# Altium schematic sheet 10_CONNECTOR.SchDoc: SENSEI Base Board - Connectors
size A3; DrawnBy: Sebastian Frey; Organization: Integrated Systems Laboratory; DocumentNumber: 11; Revision: v1.1; SheetNumber: 11; SheetTotal: 12
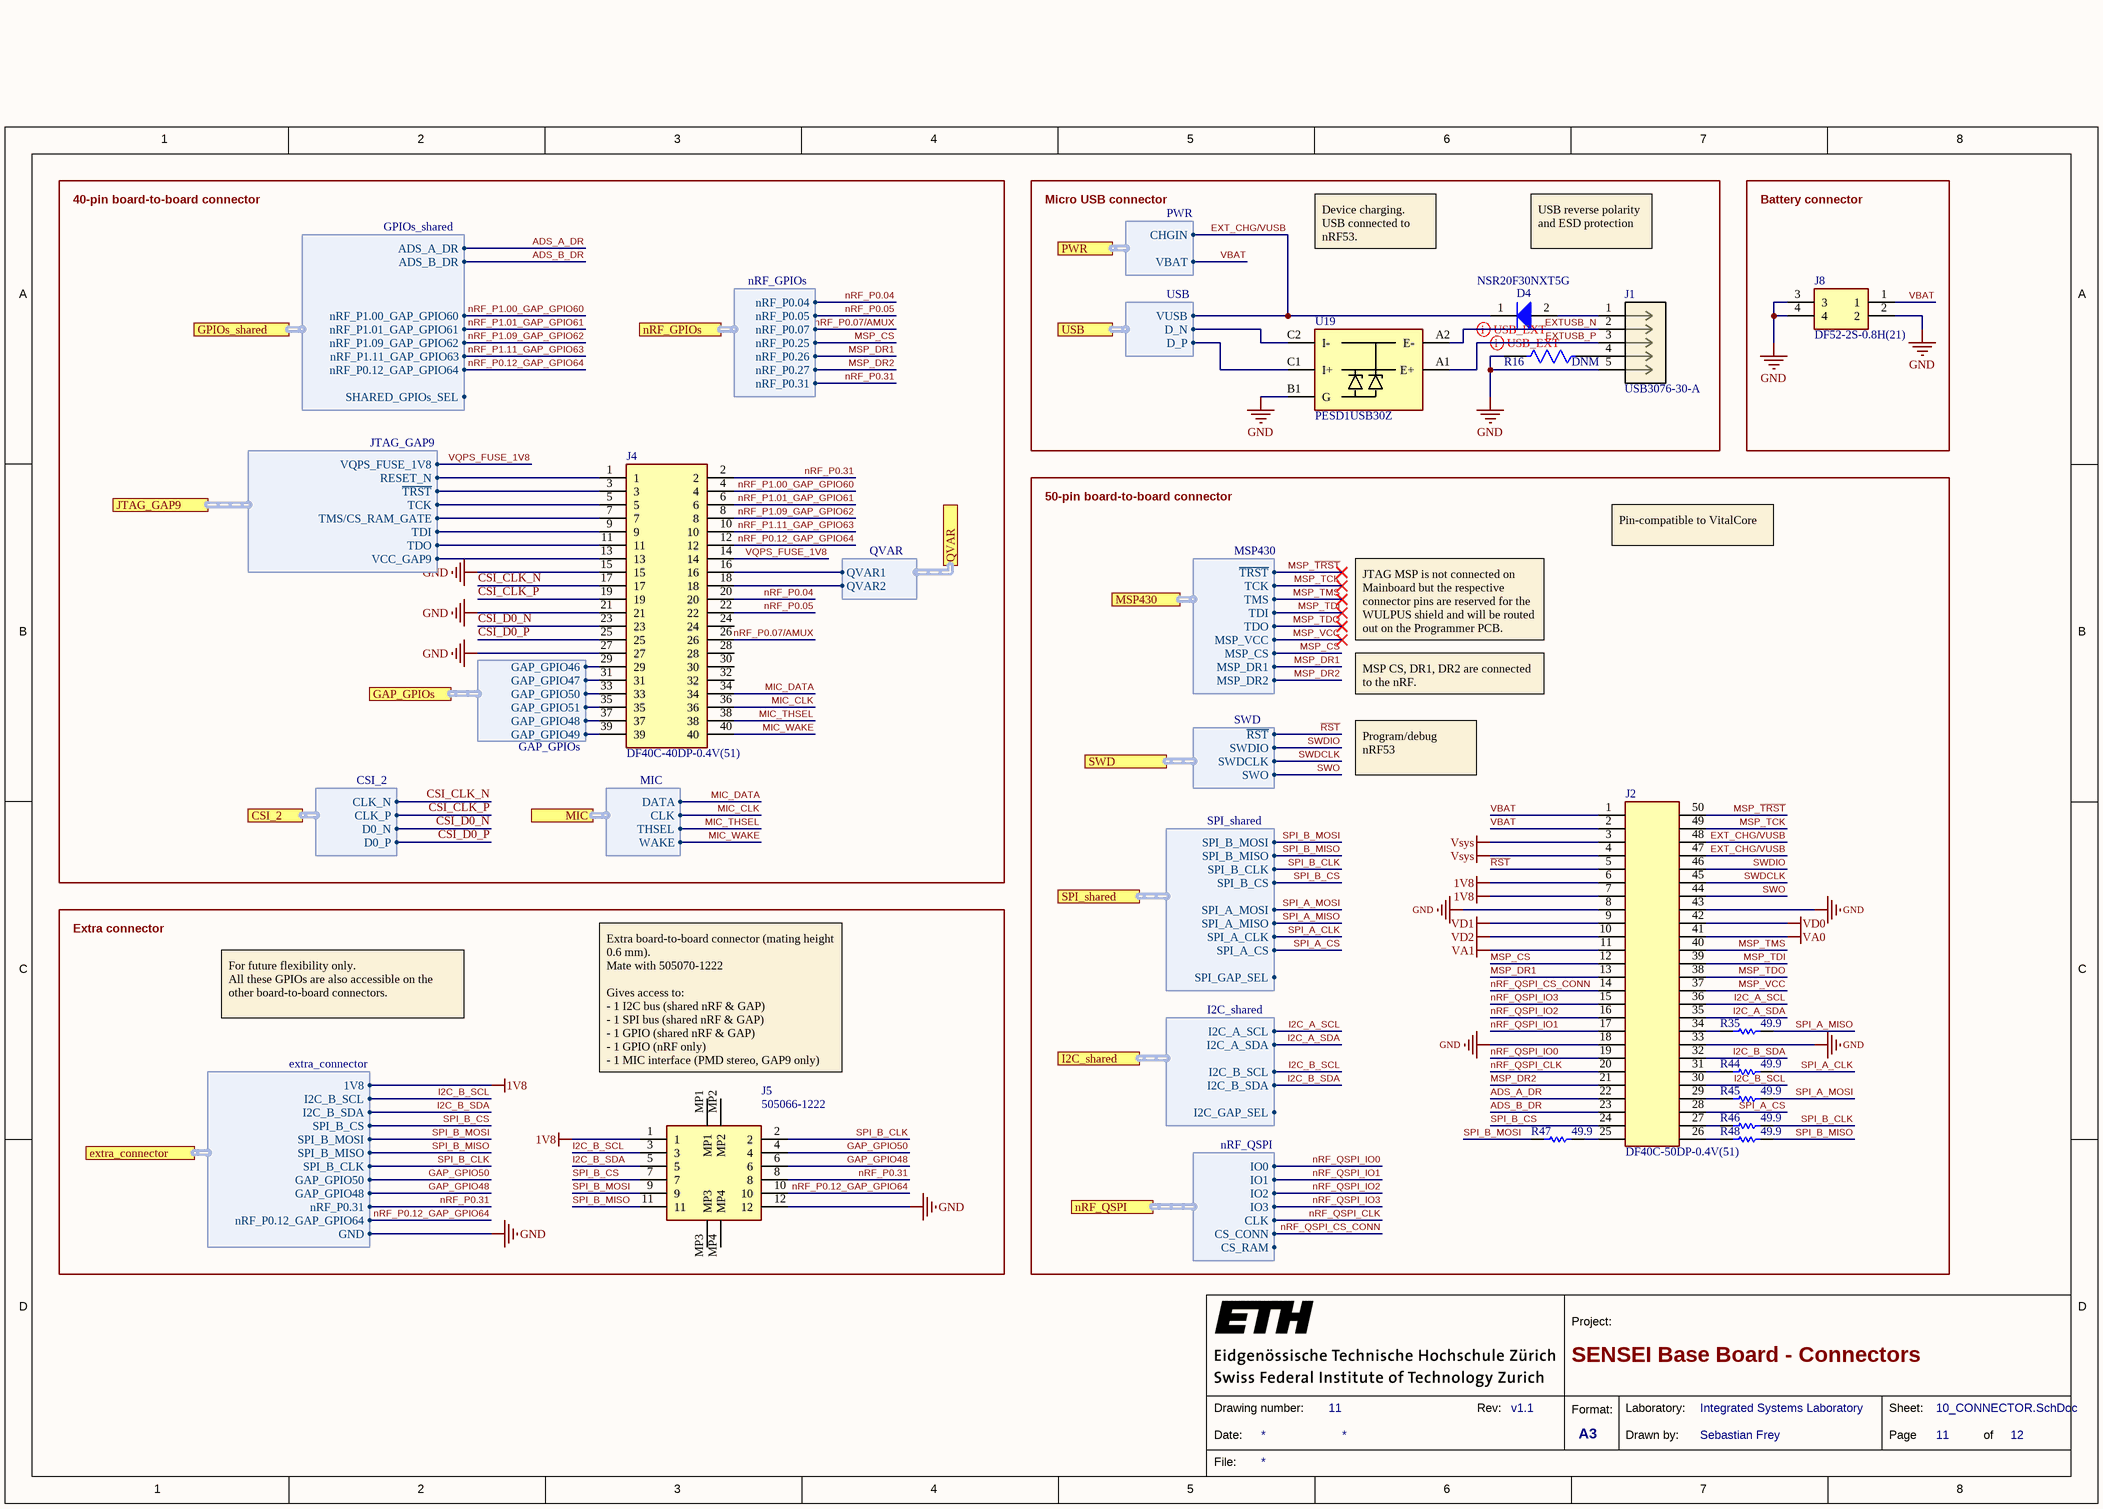
[diagram p0: 10_CONNECTOR.SchDoc]

## Parts
D4  NSR20F30NXT5G  [ONSC-DSN-2-512AB-01_V]
J1  USB3076-30-A  [CONN_USB3076-30-A_GCT]
J2  DF40C-50DP-0.4V(51)  [CONN_COMBI_50P]
J4  DF40C-40DP-0.4V(51)  [FP-DF40C-40DP-0_4V_51-MFG]
J5  505066-1222  [5050661222]
J8  DF52-2S-0.8H(21)  [DF522S08H21]
R16  DNM  [0201]
R35  Resistance: 49.9  [RESC0603X28X15ML05T05]  (hidden comment: CRCW020149R9FNED)
R44  Resistance: 49.9  [RESC0603X28X15ML05T05]  (hidden comment: CRCW020149R9FNED)
R45  Resistance: 49.9  [RESC0603X28X15ML05T05]  (hidden comment: CRCW020149R9FNED)
R46  Resistance: 49.9  [RESC0603X28X15ML05T05]  (hidden comment: CRCW020149R9FNED)
R47  Resistance: 49.9  [RESC0603X28X15ML05T05]  (hidden comment: CRCW020149R9FNED)
R48  Resistance: 49.9  [RESC0603X28X15ML05T05]  (hidden comment: CRCW020149R9FNED)
U19  PESD1USB30Z  [WLCSP_5_2-1-2_P0.4]

## Blocks framed on the sheet
40-pin board-to-board connector: J4
Micro USB connector: D4 J1 R16 U19
Battery connector: J8
50-pin board-to-board connector: J2 R35 R44-R48
Extra connector: J5

## Ports
CSI_2 (harness CSI_2), extra_connector (harness extra_connector), GAP_GPIOs (harness GAP_GPIOs), GPIOs_shared (harness GPIOs_shared), I2C_shared (harness I2C_shared), JTAG_GAP9 (harness JTAG_GAP9), MIC (harness MIC), MSP430 (harness MSP430), nRF_GPIOs (harness nRF_GPIOs), nRF_QSPI (harness nRF_QSPI), PWR (harness PWR), QVAR (harness QVAR), SPI_shared (harness SPI_shared), SWD (harness SWD), USB (harness USB)

## Harnesses
SWD: ~{RST}, SWDIO, SWDCLK, SWO
nRF_QSPI: IO0, IO1, IO2, IO3, CLK, CS_CONN, CS_RAM
SPI_shared: SPI_B_MOSI, SPI_B_MISO, SPI_B_CLK, SPI_B_CS, SPI_A_MOSI, SPI_A_MISO, SPI_A_CLK, SPI_A_CS, SPI_GAP_SEL
I2C_shared: I2C_A_SCL, I2C_A_SDA, I2C_B_SCL, I2C_B_SDA, I2C_GAP_SEL
QVAR: QVAR2, QVAR1
MSP430: ~{TRST}, TCK, TMS, TDI, TDO, MSP_VCC, MSP_DR1, MSP_DR2, MSP_CS
USB: VUSB, D_P, D_N
PWR: CHGIN, VBAT
MIC: DATA, THSEL, WAKE, CLK
GAP_GPIOs: GAP_GPIO46, GAP_GPIO47, GAP_GPIO50, GAP_GPIO51, GAP_GPIO48, GAP_GPIO49
GPIOs_shared: ADS_A_DR, ADS_B_DR, nRF_P1.00_GAP_GPIO60, nRF_P1.09_GAP_GPIO62, nRF_P1.11_GAP_GPIO63, nRF_P0.12_GAP_GPIO64, SHARED_GPIOs_SEL, nRF_P1.01_GAP_GPIO61
nRF_GPIOs: nRF_P0.07, nRF_P0.25, nRF_P0.05, nRF_P0.04, nRF_P0.26, nRF_P0.27, nRF_P0.31
CSI_2: CLK_N, CLK_P, D0_P, D0_N
extra_connector: SPI_B_CS, SPI_B_MOSI, SPI_B_MISO, SPI_B_CLK, GAP_GPIO50, GAP_GPIO48, I2C_B_SDA, nRF_P0.12_GAP_GPIO64, GND, I2C_B_SCL, 1V8, nRF_P0.31
JTAG_GAP9: ~{TRST}, TCK, TMS/CS_RAM_GATE, TDI, TDO, VCC_GAP9, RESET_N, VQPS_FUSE_1V8

## Nets
1V8: J2.6 J2.7 J5.1 ; port extra_connector.1V8
GND: J1.5 J2.8 J2.18 J2.33 J2.43 J4.15 J4.21 J4.27 J5.12 J8.2 J8.3 J8.4 R16.2 U19.B1(G) ; port extra_connector.GND
VA0: J2.41
VA1: J2.11
VD0: J2.42
VD1: J2.9
VD2: J2.10
Vsys: J2.3 J2.4
ADS_A_DR: J2.22 ; port GPIOs_shared.ADS_A_DR
ADS_B_DR: J2.23 ; port GPIOs_shared.ADS_B_DR
CSI_CLK_N: J4.17 ; port CSI_2.CLK_N
CSI_CLK_P: J4.19 ; port CSI_2.CLK_P
CSI_D0_N: J4.23 ; port CSI_2.D0_N
CSI_D0_P: J4.25 ; port CSI_2.D0_P
EXT_CHG/VUSB: D4.1(K) J2.47 J2.48 ; port USB.VUSB, port PWR.CHGIN
EXTUSB_N: J1.2 U19.A2(E-)
EXTUSB_P: J1.3 U19.A1(E+)
GAP_GPIO48: J5.6 ; port extra_connector.GAP_GPIO48
GAP_GPIO50: J5.4 ; port extra_connector.GAP_GPIO50
I2C_A_SCL: J2.36 ; port I2C_shared.I2C_A_SCL
I2C_A_SDA: J2.35 ; port I2C_shared.I2C_A_SDA
I2C_B_SCL: J2.30 J5.3 ; port I2C_shared.I2C_B_SCL, port extra_connector.I2C_B_SCL
I2C_B_SDA: J2.32 J5.5 ; port I2C_shared.I2C_B_SDA, port extra_connector.I2C_B_SDA
MIC_CLK: J4.36 ; port MIC.CLK
MIC_DATA: J4.34 ; port MIC.DATA
MIC_THSEL: J4.38 ; port MIC.THSEL
MIC_WAKE: J4.40 ; port MIC.WAKE
MSP_CS: J2.12 ; port MSP430.MSP_CS, port nRF_GPIOs.nRF_P0.25
MSP_DR1: J2.13 ; port MSP430.MSP_DR1, port nRF_GPIOs.nRF_P0.26
MSP_DR2: J2.21 ; port MSP430.MSP_DR2, port nRF_GPIOs.nRF_P0.27
MSP_~{TRST}: J2.50 ; port MSP430.~{TRST}
MSP_TCK: J2.49 ; port MSP430.TCK
MSP_TDI: J2.39 ; port MSP430.TDI
MSP_TDO: J2.38 ; port MSP430.TDO
MSP_TMS: J2.40 ; port MSP430.TMS
MSP_VCC: J2.37 ; port MSP430.MSP_VCC
nRF_P0.04: J4.20 ; port nRF_GPIOs.nRF_P0.04
nRF_P0.05: J4.22 ; port nRF_GPIOs.nRF_P0.05
nRF_P0.07/AMUX: J4.26 ; port nRF_GPIOs.nRF_P0.07
nRF_P0.12_GAP_GPIO64: J4.12 J5.10 ; port GPIOs_shared.nRF_P0.12_GAP_GPIO64, port extra_connector.nRF_P0.12_GAP_GPIO64
nRF_P0.31: J4.2 J5.8 ; port nRF_GPIOs.nRF_P0.31, port extra_connector.nRF_P0.31
nRF_P1.00_GAP_GPIO60: J4.4 ; port GPIOs_shared.nRF_P1.00_GAP_GPIO60
nRF_P1.01_GAP_GPIO61: J4.6 ; port GPIOs_shared.nRF_P1.01_GAP_GPIO61
nRF_P1.09_GAP_GPIO62: J4.8 ; port GPIOs_shared.nRF_P1.09_GAP_GPIO62
nRF_P1.11_GAP_GPIO63: J4.10 ; port GPIOs_shared.nRF_P1.11_GAP_GPIO63
nRF_QSPI_CLK: J2.20 ; port nRF_QSPI.CLK
nRF_QSPI_CS_CONN: J2.14 ; port nRF_QSPI.CS_CONN
nRF_QSPI_IO0: J2.19 ; port nRF_QSPI.IO0
nRF_QSPI_IO1: J2.17 ; port nRF_QSPI.IO1
nRF_QSPI_IO2: J2.16 ; port nRF_QSPI.IO2
nRF_QSPI_IO3: J2.15 ; port nRF_QSPI.IO3
~{RST}: J2.5 ; port SWD.~{RST}
SPI_A_CLK: R44.2 ; port SPI_shared.SPI_A_CLK
SPI_A_CS: J2.28 ; port SPI_shared.SPI_A_CS
SPI_A_MISO: R35.2 ; port SPI_shared.SPI_A_MISO
SPI_A_MOSI: R45.2 ; port SPI_shared.SPI_A_MOSI
SPI_B_CLK: J5.2 R46.2 ; port SPI_shared.SPI_B_CLK, port extra_connector.SPI_B_CLK
SPI_B_CS: J2.24 J5.7 ; port SPI_shared.SPI_B_CS, port extra_connector.SPI_B_CS
SPI_B_MISO: J5.11 R48.2 ; port SPI_shared.SPI_B_MISO, port extra_connector.SPI_B_MISO
SPI_B_MOSI: J5.9 R47.1 ; port SPI_shared.SPI_B_MOSI, port extra_connector.SPI_B_MOSI
SWDCLK: J2.45 ; port SWD.SWDCLK
SWDIO: J2.46 ; port SWD.SWDIO
SWO: J2.44 ; port SWD.SWO
VBAT: J2.1 J2.2 J8.1 ; port PWR.VBAT
VQPS_FUSE_1V8: J4.14 ; port JTAG_GAP9.VQPS_FUSE_1V8
NetD4_2: D4.2(A) J1.1
NetJ1_4: J1.4 R16.1
NetJ2_25: J2.25 R47.2
NetJ2_26: J2.26 R48.1
NetJ2_27: J2.27 R46.1
NetJ2_29: J2.29 R45.1
NetJ2_31: J2.31 R44.1
NetJ2_34: J2.34 R35.1
NetJ4_1: J4.1 ; port JTAG_GAP9.RESET_N
NetJ4_3: J4.3 ; port JTAG_GAP9.~{TRST}
NetJ4_5: J4.5 ; port JTAG_GAP9.TCK
NetJ4_7: J4.7 ; port JTAG_GAP9.TMS/CS_RAM_GATE
NetJ4_9: J4.9 ; port JTAG_GAP9.TDI
NetJ4_11: J4.11 ; port JTAG_GAP9.TDO
NetJ4_13: J4.13 ; port JTAG_GAP9.VCC_GAP9
NetJ4_16: J4.16 ; port QVAR.QVAR1
NetJ4_18: J4.18 ; port QVAR.QVAR2
NetJ4_29: J4.29 ; port GAP_GPIOs.GAP_GPIO46
NetJ4_31: J4.31 ; port GAP_GPIOs.GAP_GPIO47
NetJ4_33: J4.33 ; port GAP_GPIOs.GAP_GPIO50
NetJ4_35: J4.35 ; port GAP_GPIOs.GAP_GPIO51
NetJ4_37: J4.37 ; port GAP_GPIOs.GAP_GPIO48
NetJ4_39: J4.39 ; port GAP_GPIOs.GAP_GPIO49
NetU19_C1: U19.C1(I+) ; port USB.D_P
NetU19_C2: U19.C2(I-) ; port USB.D_N

Not connected (* = marked no-connect by the designer): J4 24 28 30 32; J5 MP1 MP2 MP3 MP4

## Layout directives
differential pair: EXTUSB_N, EXTUSB_P

## Notes on the sheet
- Device charging.
  USB connected to nRF53.
- USB reverse polarity and ESD protection
- Pin-compatible to VitalCore
- JTAG MSP is not connected on Mainboard but the respective connector pins are reserved for the WULPUS shield and will be routed out on the Programmer PCB.
- MSP CS, DR1, DR2 are connected to the nRF.
- Program/debug nRF53
- For future flexibility only.
  All these GPIOs are also accessible on the other board-to-board connectors.
- Extra board-to-board connector (mating height 0.6 mm).
  Mate with 505070-1222
  Gives access to:
  - 1 I2C bus (shared nRF & GAP)
  - 1 SPI bus (shared nRF & GAP)
  - 1 GPIO (shared nRF & GAP)
  - 1 GPIO (nRF only)
  - 1 MIC interface (PMD stereo, GAP9 only)
- 1
- 2
- 3
- 4
- 5
- 6
- 7
- 8
- A
- B
- C
- D
- Project:
- Date:
- Drawing number:
- Rev:
- Format:
- A3
- Drawn by:
- Laboratory:
- Page
- Sheet:
- of
- File:

## Library data of the parts
D4 = CMP-1055-00233-1: Schottky Barrier Diode, 2-Pin DSN, Pb-Free, Tape and Reel; Manufacturer: On Semiconductor; IFSM Max (A): 28; Configuration: Single; ComponentLink2URL: http://www.onsemi.com/pub_link/Collateral/NSR20F30-D.PDF; ComponentLink1URL: http://www.onsemi.com/; ComponentLink2Description: Datasheet; PackageVersion: Rev. B, 01/2011; Mounting Technology: Surface Mount; DatasheetVersion: Rev. 3; Packing: Tape and Reel; PartNumber: NSR20F30NXT5G; ComponentLink3Description: Package Specification; RoHS: TRUE; PackageDescription: 2-Pin Micro Molded Package, Body 1.6 x 0.8 mm; ComponentLink3URL: http://www.onsemi.cn/pub_link/Collateral/152AB.PDF; ComponentLink1Description: Manufacturer URL; PackageReference: DSN-2-512AB-01
J1 = USB3076-30-A: No Description Available; Mfr_Name: Global Connector Technology; Copyright: Copyright (C) 2023 Ultra Librarian. All rights reserved.; Manufacturer_Part_Number: USB3076-30-A; RefDes: RefDes; Type: DEV
J2 = CONN_50P_M_COMBI_INTERFACE: 50Pin 0.4mm pitch connector footprint that accepts (male) connectors intended for different stacking heights: / Hirose - DF40C-50DP-0.4V(51) for 1.5mm - 3mm stacking height / JAE - WP7B-P050VA1-R8000 - for 0.7mm stacking height
J4 = DF40C-40DP-0.4V(51): CONN PLUG 40POS SMD GOLD; Number of Contacts: 40; Gender: Male; Voltage Rating: 30V; Mated Stacking Heights: 4mm; Current Rating: 300mA; Pitch: 0.4mm; Connector Type: Plug; Lead Free: Lead Free; Number of Positions: 40; Packaging: Tape and Reel; Contact Plating: Gold; REACH SVHC: No SVHC; Mount: Surface Mount; Orientation: Straight; Housing Material: Polymer; Termination: SMD/SMT; Min Operating Temperature: -35°C; Number of Rows: 2; Max Operating Temperature: 85°C; Contact Material: Bronze; Package Quantity: 1
J5 = 505066-1222: Connector; Manufacturer_Name: Molex; Datasheet Link: https://www.molex.com/pdm_docs/sd/5050661222_sd.pdf; Height: 0.63mm; Manufacturer_Part_Number: 505066-1222; Mouser Part Number: 538-505066-1222; Mouser Price/Stock: https://www.mouser.co.uk/ProductDetail/Molex/505066-1222?qs=byeeYqUIh0OlQo7UKX%2FsWw%3D%3D
J8 = DF52-2S-0.8H_21_: Connector; Manufacturer_Name: Hirose; Datasheet Link: https://datasheet.datasheetarchive.com/originals/distributors/DKDS-30/591726.pdf; Height: 1mm; Manufacturer_Part_Number: DF52-2S-0.8H(21); Mouser Part Number: 798-DF52-2S-0.8H21; Mouser Price/Stock: https://www.mouser.co.uk/ProductDetail/Hirose-Connector/DF52-2S-0.8H21?qs=%2FKR40Cd6GUpAHUMGMtWbig%3D%3D
R16 = RES DNM: Resistor; Value: DNM
R35 R44-R48 = CMP-2004-00655-1: Manufacturer: Vishay Dale; Part Number: CRCW020149R9FNED
U19 = PESD1USB30: ESD Suppressor Diode TVS Uni-Dir 5V 5-Pin WLCSP T/R; Manufacturer: NXP Semiconductors; Manufacturer Part Number: PESD1USB30; Supplier 1: Mouser; Supplier Part Number 1: 771-PESD1USB30Z